# EAGLE design IVPSUV2 (EAGLE 5.07)
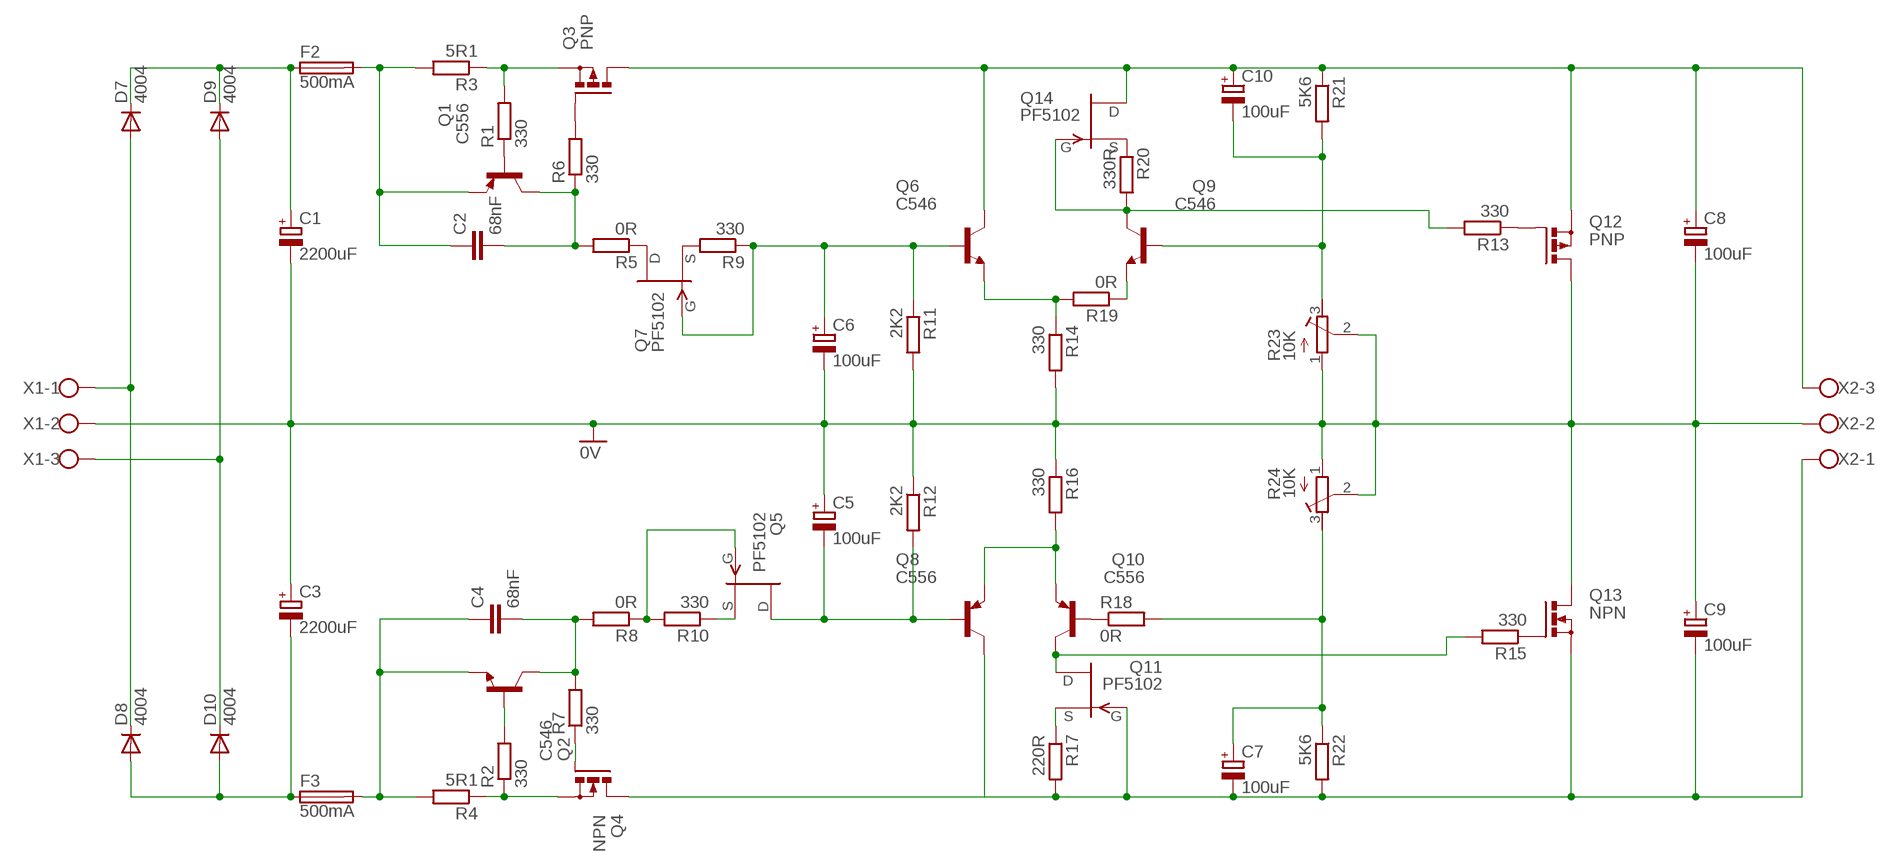
[diagram p0: schematic, sheet 1]

## Parts
C1  2200uF  CPOL-EUE7.5-18  [E7,5-18]
C2  68nF  C5/3.5  [C5B3.5]
C3  2200uF  CPOL-EUE7.5-18  [E7,5-18]
C4  68nF  C5/3.5  [C5B3.5]
C5  100uF  CPOL-EUE5-10.5  [E5-10,5]
C6  100uF  CPOL-EUE5-10.5  [E5-10,5]
C7  100uF  CPOL-EUE5-10.5  [E5-10,5]
C8  100uF  CPOL-EUE5-13  [E5-13]
C9  100uF  CPOL-EUE5-13  [E5-13]
C10  100uF  CPOL-EUE5-10.5  [E5-10,5]
D7  4004  1N4004  [DO41-10]
D8  4004  1N4004  [DO41-10]
D9  4004  1N4004  [DO41-10]
D10  4004  1N4004  [DO41-10]
F2  500mA  19560  [19560]
F3  500mA  19560  [19560]
Q1  C556  BC556  [TO92-EBC]
Q2  C546  BC546A  [TO92-EBC]
Q3  PNP  PMOSFET_PTO220BH  [TO220BH]
Q4  NPN  PMOSFET_NTO220BH  [TO220BH]
Q5  PF5102  2N5484  [TO92-]
Q6  C546  BC546A  [TO92-EBC]
Q7  PF5102  2N5484  [TO92-]
Q8  C556  BC556  [TO92-EBC]
Q9  C546  BC546A  [TO92-EBC]
Q10  C556  BC556  [TO92-EBC]
Q11  PF5102  2N5484  [TO92-]
Q12  PNP  PMOSFET_PTO220BH  [TO220BH]
Q13  NPN  PMOSFET_NTO220BH  [TO220BH]
Q14  PF5102  2N5484  [TO92-]
R1  330  R-EU_0204/7  [0204/7]
R2  330  R-EU_0204/7  [0204/7]
R3  5R1  R-EU_0309/12  [0309/12]
R4  5R1  R-EU_0309/12  [0309/12]
R5  0R  R-EU_0204/7  [0204/7]
R6  330  R-EU_0204/7  [0204/7]
R7  330  R-EU_0204/7  [0204/7]
R8  0R  R-EU_0204/7  [0204/7]
R9  330  R-EU_0204/7  [0204/7]
R10  330  R-EU_0204/7  [0204/7]
R11  2K2  R-EU_0204/7  [0204/7]
R12  2K2  R-EU_0204/7  [0204/7]
R13  330  R-EU_0204/7  [0204/7]
R14  330  R-EU_0204/7  [0204/7]
R15  330  R-EU_0204/7  [0204/7]
R16  330  R-EU_0204/7  [0204/7]
R17  220R  R-EU_0204/7  [0204/7]
R18  0R  R-EU_0204/7  [0204/7]
R19  0R  R-EU_0204/7  [0204/7]
R20  330R  R-EU_0204/7  [0204/7]
R21  5K6  R-EU_0204/7  [0204/7]
R22  5K6  R-EU_0204/7  [0204/7]
R23  10K  R-TRIMM64W  [RTRIM64W]
R24  10K  R-TRIMM64W  [RTRIM64W]
X1  W237-103  [W237-103]
X2  W237-103  [W237-103]

## Nets
0V: C1.- C3.+ C5.+ C6.- C8.- C9.+ Q12.D Q13.D R11.2 R12.1 R14.2 R16.1 R23.1(E) R23.2(S) R24.1(E) R24.2(S) X1.2 X2.2
N$1: Q1.B R1.1
N$2: C2.2 Q1.C R5.2 R6.1
N$3: D7.A D8.C X1.1
N$4: D9.A D10.C X1.3
N$5: Q7.3(D) R5.1
N$6: C4.2 Q2.C R7.2 R8.2
N$7: Q2.B R2.2
N$8: C1.+ D7.C D9.C F2.1
N$9: Q7.2(S) R9.2
N$10: C6.+ Q6.B Q7.1(G) R9.1 R11.1
N$11: Q3.S R1.2 R3.1
N$12: Q4.S R2.1 R4.1
N$13: C4.1 F3.2 Q2.E R4.2
N$14: Q5.1(G) R8.1 R10.2
N$15: C2.1 F2.2 Q1.E R3.2
N$16: Q3.G R6.2
N$17: Q4.G R7.1
N$18: Q5.2(S) R10.1
N$19: C7.+ R18.2 R22.1 R24.3(A)
N$20: C5.- Q5.3(D) Q8.B R12.2
N$21: Q6.E R14.1 R19.2
N$22: Q8.E Q10.E R16.2
N$23: C7.- C9.- Q4.D Q8.C Q11.1(G) Q13.S R17.2 R22.2 X2.1
N$24: Q11.2(S) R17.1
N$25: Q12.G R13.1
N$26: C8.+ C10.+ Q3.D Q6.C Q12.S Q14.3(D) R21.1 X2.3
N$27: Q10.C Q11.3(D) R15.2
N$28: Q10.B R18.1
N$29: Q9.E R19.1
N$30: Q9.C Q14.1(G) R13.2 R20.2
N$31: Q14.2(S) R20.1
N$32: C10.- Q9.B R21.2 R23.3(A)
N$50: Q13.G R15.1
N$60: C3.- D8.A D10.A F3.1

## Library data of the parts
C1 C3 C5-C10 = resistor:CPOL-EU: POLARIZED CAPACITOR, European symbol
C2 C4 = capacitor-wima:C: CAPACITOR naming: grid - package width
D7-D10 = diode:1N4004: DIODE general purpose rectifier, 1 A
F2 F3 = fuse:19560: FUSE HOLDER TR5, Wickmann
Q1 Q8 Q10 = transistor-pnp:BC556*: PNP Transistror
Q2 Q6 Q9 = transistor-npn:BC546*: NPN Transistor
Q3 Q12 = transistor-power:PMOSFET_P: Power MOSFET P-Channel
Q4 Q13 = transistor-power:PMOSFET_N: Power MOSFET N-Channel
Q5 Q7 Q11 Q14 = transistor-fet:?548*: N-Channel JFETs Source: VISHAY 2N5484.pdf Compatible: TO92 2N5245 J304 J305 U310 J308 J309 J310 TO72 2N4416 2N4416A 2N3823 2N4351 3N169 3N170 3N171 MFE3002 TO18 2N3796 2N3797 MFE825 Source: Motorola European Master Guide Pacge 3-59
R1-R22 = resistor:R-EU_: RESISTOR, European symbol
R23 R24 = resistor:R-TRIMM: Trimm resistor
X1 X2 = con-wago-500:W237-103: WAGO SCREW CLAMP

## Board
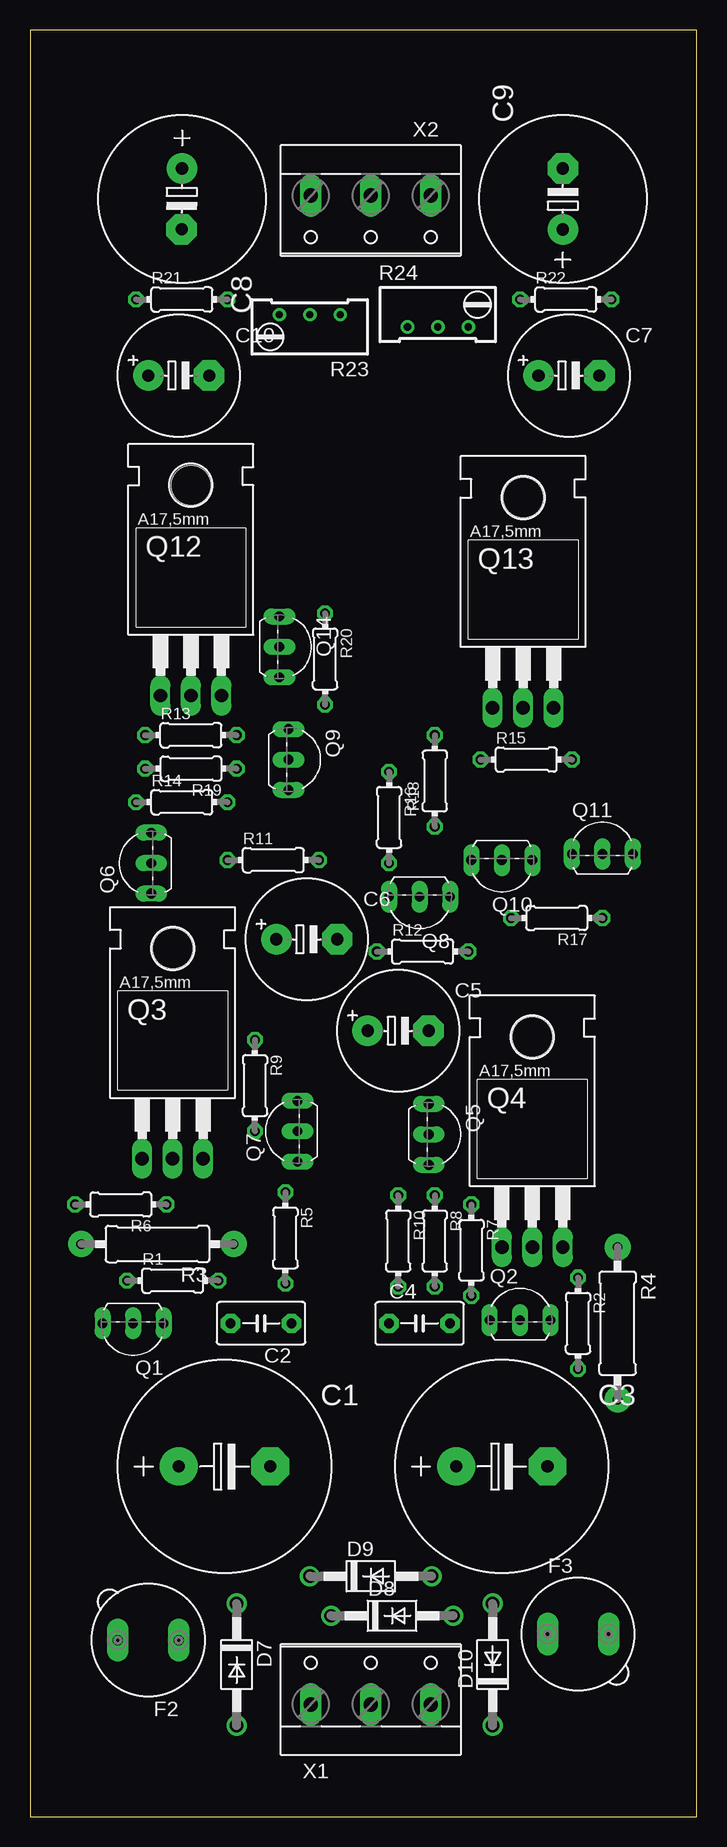
[diagram p1: board, top side]
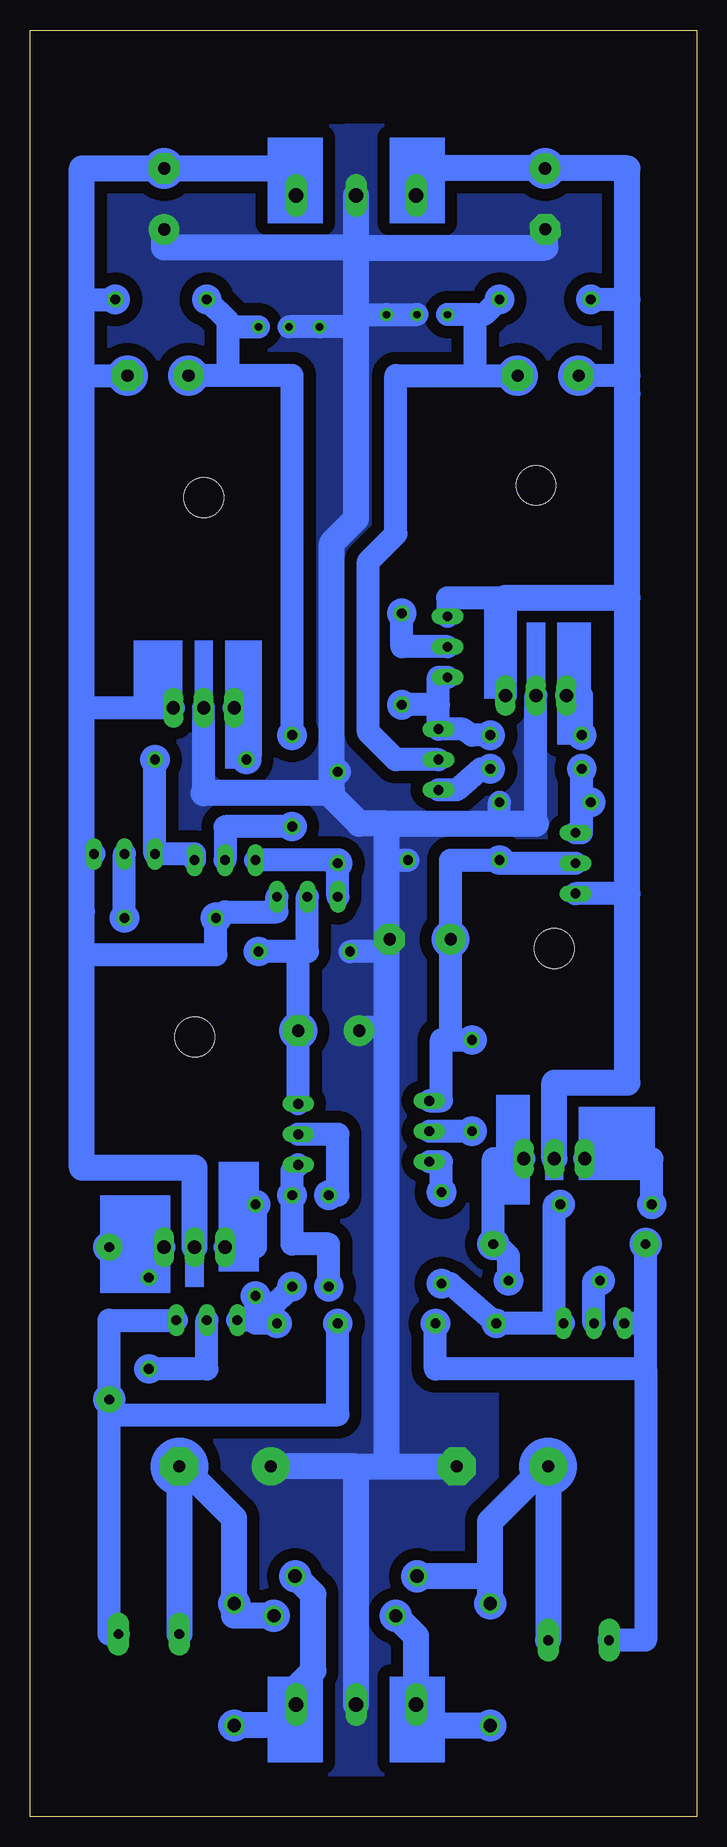
[diagram p2: board, bottom side, seen from below]

Size 55.58 x 148.95 mm. Coordinates in mm from the lower left corner, seen from the top.
Outline: 55.58,0 55.55,148.95 0,148.95 0.03,0 55.58,0
Copper layers (1*16): Top 0.035mm / dielectric 1.5mm / Bottom 0.035mm
Design rules "default": minimum track width 10mil, minimum drill 24mil, track to track 8mil, track to pad 8mil, pad to pad 8mil, via to via 8mil, smd to smd 8mil, copper to edge 40mil, drill to drill 8mil, minimum pad ring 10mil, minimum via ring 8mil, stop-mask expansion 4mil, vias tented up to drill 0mil, thermal gap 10mil

### Footprints (pad centres in the part's own frame; a part is rotated, then mirrored left to right if it is on the bottom)
E7,5-18 = drill 1.016 pad 3.15 round: + -3.81,0 | drill 1.016 pad 3.15 octagon: - 3.81,0
C5B3.5 = drill 0.813 pad 1.6 octagon: 1 -2.54,0; 2 2.54,0
E5-10,5 = drill 1.016 pad 2.54 round: + -2.54,0 | drill 1.016 pad 2.54 octagon: - 2.54,0
E5-13 = drill 1.016 pad 2.54 round: + -2.54,0 | drill 1.016 pad 2.54 octagon: - 2.54,0
DO41-10 = drill 1.118 round: A 5.08,0; C -5.08,0
19560 = drill 0.813 pad 1.778 long: 1 -2.54,0; 2 2.54,0
TO92-EBC = drill 0.813 long: B 0,-1.27; C -2.54,-1.27; E 2.54,-1.27
TO220BH = drill 1.118 long: D 0,-6.35; G -2.54,-6.35; S 2.54,-6.35 | hole 3.302: 0,11.176
TO92- = drill 0.813 long: 1 2.54,0; 2 0,0; 3 -2.54,0
0204/7 = drill 0.813 octagon: 1 -3.81,0; 2 3.81,0
0309/12 = drill 0.8 pad 2.184 round: 1 -6.35,0; 2 6.35,0
RTRIM64W = drill 0.61 round: 1 1.27,-2.54; 2 1.27,0; 3 1.27,2.54
W237-103 = drill 1.194 long: 1 -5,-1.29; 2 0,-1.29; 3 5,-1.29

### Placement (x,y rotation side)
C1  16.21,29.21 0 top
C2  19.25,41.15 180 top
C3  39.32,29.21 0 top
C4  32.46,41.15 0 top
C5  30.68,65.53 0 top
C6  23.06,73.15 0 top
C7  44.91,120.14 0 top
C8  12.65,134.87 269.7 top
C9  44.4,134.87 90 top
C10  12.4,120.14 0 top
D7  17.22,12.7 270 top
D8  30.18,16.76 0 top
D9  28.4,20.07 0 top
D10  38.56,12.7 90 top
F2  9.86,14.73 180 top
F3  45.67,15.24 0 top
Q1  8.59,39.88 180 top
Q2  40.84,42.67 0 top
Q3  11.89,61.21 0 top
Q4  41.86,53.85 0 top
Q5  33.22,56.9 270 top
Q6  8.84,79.5 90 top
Q7  22.3,57.15 90 top
Q8  32.46,75.44 180 top
Q9  22.81,88.14 270 top
Q10  39.32,78.49 180 top
Q11  47.7,80.26 0 top
Q12  13.41,99.82 0 top
Q13  41.1,98.81 0 top
Q14  20.78,97.54 270 top
R1  11.89,44.7 0 top
R2  45.67,41.15 270 top
R3  10.62,47.75 180 top
R4  48.97,41.15 270 top
R5  5K6  [0204/7]  21.29,48.26 270 top
R6  7.57,51.05 180 top
R7  36.78,47.24 270 top
R8  5K6  [0204/7]  33.73,48.01 270 top
R9  18.75,60.96 270 top
R10  30.68,48.01 270 top
R11  20.27,79.76 0 top
R12  32.72,72.14 0 top
R13  13.41,90.17 0 top
R14  12.65,84.58 0 top
R15  41.35,88.14 0 top
R16  29.92,83.31 270 top
R17  43.89,74.93 180 top
R18  33.73,86.36 90 top
R19  13.41,87.38 180 top
R20  220R  [0204/7]  24.59,96.52 270 top
R21  12.65,126.49 0 top
R22  44.65,126.49 0 top
R23  5K  [RTRIM64W]  23.32,123.95 90 top
R24  5K  [RTRIM64W]  33.99,125.48 270 top
X1  28.4,10.67 0 top
X2  28.4,133.86 180 top

### Tracks (layer width: path | path; a pad name or v marks a point on that pad's centre or on a via)
0V
  Bottom 1.93: 25.86,79.76 R11.2 | C6.- 25.6,73.41 25.86,73.41 | 25.86,72.14 R12.1 | C5.+ 28.14,65.79 25.86,65.79 | 16.46,82.8 R14.2 | 13.41,82.8 Q12.D | 41.1,85.34 Q13.D | R23.2 R23.1 28.4,125.22 | R24.2 R24.1 28.4,124.21
  Bottom 2.184: X1.2 28.4,29.21 | 28.4,29.21 C3.+ | 25.86,29.21 C1.- | C9.+ 44.4,130.81 28.4,130.81 | 28.4,130.81 12.65,130.81 12.64,130.82 C8.- | 28.4,130.81 X2.2 | 25.86,82.8 16.46,82.8 13.41,82.8 | 28.4,29.21 25.86,29.21 | 25.86,29.21 25.86,65.79 25.86,72.14 25.86,73.41 25.86,79.76 25.86,82.8 | 30.68,85.34 41.1,85.34 | 30.68,85.34 28.14,82.8 25.86,82.8 | 30.68,85.34 30.43,85.6 30.43,87.12 | R16.1 30.18,86.87 30.43,87.12 | 28.4,130.81 28.4,125.22 28.4,124.21 28.4,108.2 30.43,106.17 30.43,87.12
  pour Bottom (isolate 1.016, no thermals): 5.28,141.22 16.71,35.81 16.71,3.56 36.78,3.56 53.29,140.72
N$1
  Bottom 1.93: Q1.B 8.59,44.7 R1.1
N$2
  Bottom 1.93: Q1.C 11.89,41.15 | 11.89,41.15 11.89,51.05 R6.1 | 11.89,41.15 C2.2 20.52,44.45 R5.2
N$3
  Bottom 2.184: D8.C 23.4,15.07 X1.1 23.4,7.7 23.32,7.62 D7.A
N$4
  Bottom 2.184: D10.C 33.48,7.62 33.4,7.7 X1.3 33.4,10.75 31.95,12.19 31.95,18.54 D9.A
N$5
  Bottom 1.93: Q7.3 21.29,54.61 R5.1
N$6
  Bottom 1.93: 36.78,41.4 36.78,42.16 | 36.78,42.16 R7.2 | 36.78,41.4 Q2.C | C4.2 36.78,41.15 36.78,41.4 | R8.2 35.76,42.16 36.78,42.16
N$7
  Bottom 1.93: R2.2 40.84,37.34 Q2.B
N$8
  Bottom 2.184: 17.22,18.03 D7.C 17.22,20.07 | F2.1 C1.+ 12.65,29.21 17.22,24.64 17.22,20.07 | 17.22,20.07 D9.C
N$9
  Bottom 1.93: R9.2 Q7.2
N$10
  Bottom 1.93: Q7.1 21.29,59.69 21.29,64.77 20.52,64.77 | 20.52,64.77 R9.1 | 20.52,64.77 C6.+ 20.52,79.76 R11.1 16.46,79.5 Q6.B
N$11
  Bottom 1.93: Q3.S 16.97,54.86 R3.1 16.71,47.75 15.7,46.74 R1.2
N$12
  Bottom 1.93: 45.67,47.5 Q4.S | 45.67,47.5 R4.1 | R2.1 45.67,47.5
N$13
  Bottom 1.93: Q2.E 48.97,41.4 R4.2 48.97,33.53 | F3.2 48.97,15.24 48.97,33.53 | 48.97,33.53 29.92,33.53 C4.1
N$14
  Bottom 1.93: Q5.1 33.73,53.85 R8.1 33.73,47.75 30.68,47.75 R10.2
N$15
  Bottom 1.93: 4.01,47.75 R3.2 4.27,41.15 | F2.2 4.27,14.73 4.27,37.34 | 4.27,41.15 Q1.E | 4.27,37.34 4.27,41.15 | C2.1 21.79,37.34 4.27,37.34
N$16
  Bottom 1.93: Q3.G 3.76,54.86 R6.2
N$17
  Bottom 1.93: Q4.G 36.78,47.5 R7.1
N$18
  Bottom 1.93: Q5.2 29.92,56.9 29.92,51.82 R10.1
N$19
  Bottom 1.93: R18.2 33.73,120.14 39.07,120.14 | 39.07,120.14 C7.+ | 39.07,124.21 R24.3 | 39.07,120.14 39.07,122.94 39.07,124.21 | R22.1 39.07,124.71 39.07,124.21
N$20
  Bottom 1.93: 33.22,72.14 C5.- Q5.3 | 33.22,72.14 R12.2 | Q8.B 32.46,72.14 33.22,72.14
N$21
  Bottom 1.93: 9.6,84.58 R19.2 | Q6.E 9.6,82.04 9.6,84.58 | 9.6,84.58 R14.1
N$22
  Bottom 1.93: Q8.E R16.2 29.92,79.76 Q10.E
N$23
  Bottom 1.93: Q8.C 35,75.44 39.32,75.44 R17.2 40.08,71.88 51.26,71.88 | 51.26,80.26 Q11.1 | 51.26,75.44 51.26,75.18 | 51.26,126.49 R22.2 | 51.26,120.14 C7.- | 51.26,92.46 Q13.S
  Bottom 2.184: X2.1 33.4,137.33 33.48,137.41 C9.- 51.26,137.41 51.26,126.49 51.26,120.14 51.26,92.46 51.26,80.26 51.26,75.44 51.26,71.88 51.26,54.1 41.86,54.1 Q4.D
N$24
  Bottom 1.93: R17.1 Q11.2
N$25
  Bottom 1.93: Q12.G 9.6,93.47 R13.1
N$26
  Bottom 1.93: 5.79,76.96 Q6.C | 5.79,76.96 | C10.+ | 5.79,120.14 C10.+ | R21.1 | 5.79,126.49 R21.1 | Q14.3 20.78,101.6 15.95,101.6 Q12.S
  Bottom 2.184: X2.3 23.4,137.33 23.32,137.41 13.67,137.41 C8.+ 6.55,137.41 5.79,137.41 5.79,126.49 5.79,120.14 5.79,118.62 5.8,101.61 | Q3.D 11.89,61.21 5.79,61.21 5.79,76.96 5.8,101.61 | 15.95,101.6 13.66,101.61 5.8,101.61
N$27
  Bottom 1.93: Q10.C 41.86,80.26 Q11.3 R15.2
N$28
  Bottom 1.93: R18.1 39.32,82.55 Q10.B
N$29
  Bottom 1.93: R19.1 17.98,87.38 20.02,85.6 Q9.E
N$30
  Bottom 1.93: 21.54,92.71 Q9.C 19.51,90.68 18.75,90.17 R13.2 | 21.54,92.71 R20.2 | Q14.1 21.54,95 21.54,92.71
N$31
  Bottom 1.93: Q14.2 24.59,97.54 R20.1
N$32
  Bottom 1.93: Q9.B 25.1,88.14 27.38,90.42 27.38,104.65 25.1,106.93 25.1,120.14 18.49,120.14 | 18.49,120.14 C10.- | 18.49,125.22 R23.3 | 18.49,120.14 18.49,125.22 | R21.2 17.73,125.22 18.49,125.22
N$50
  Bottom 1.93: R15.1 37.54,92.46 Q13.G
N$60
  Bottom 2.184: D8.A 38.56,16.76 D10.A 38.56,24.89 42.88,29.21 C3.- F3.1
(copper drawn outside any net)
  shapes: Bottom area x23, Bottom circle x68